# Altium schematic sheet MAZ000181 - Diagrama físico.SchDoc: MAZ000181 - Diagrama físico
size A; ApprovedBy: Christian Ledwidth; CheckedBy: Nahuel Martinez; Author: Santiago Marti; CompanyName: Body Health; DrawnBy: Santiago Marti; Revision: A; SheetNumber: 2; SheetTotal: 2
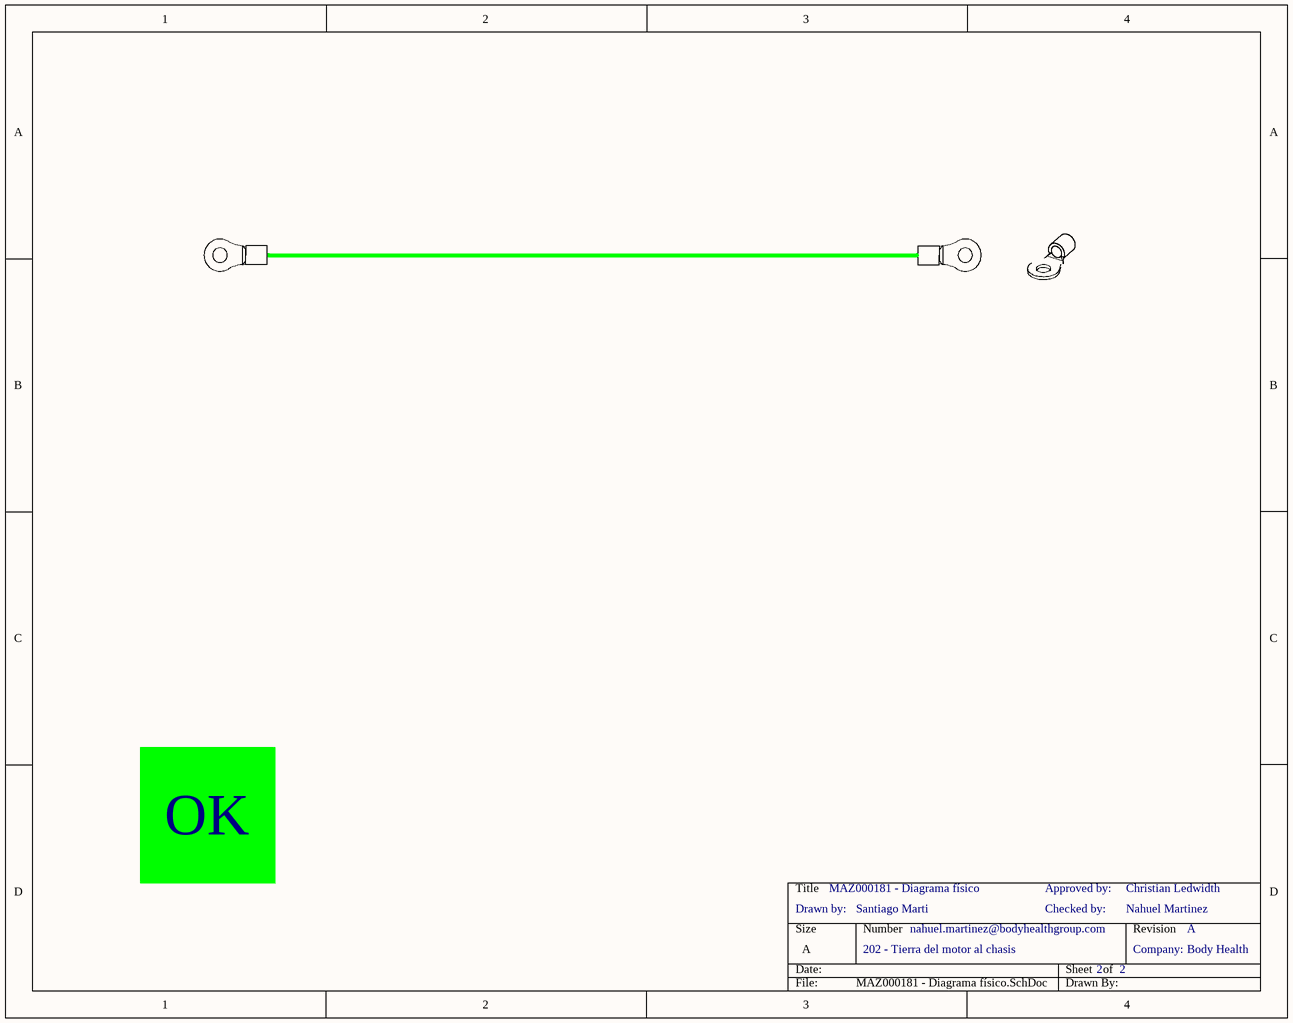
[diagram p0: MAZ000181 - Diagrama físico.SchDoc]

## Parts
Con5  Ring  (value not drawn)  (parts A,B of 4)
Con?  Ring  (value not drawn)  (part A of 4)

## Notes on the sheet
- OK
- Drawn by:
- Checked by:
- Approved by:
- 202 - Tierra del motor al chasis
- nahuel.martinez@bodyhealthgroup.com
- Company:

## Library data of the parts
Con5 Con? = Ring: CONN HOUSING RING M4; Cod.DigiKey: -; Cod.Fabricante: -; ComponentLink1Description: Manufacturer Link; ComponentLink1URL: -; DIGIKEYx50: -; Fabricante: -; CallOut: *; DIGIKEYx100: -